# Altium schematic sheet MultiChannelLdc3.SchDoc
size A4
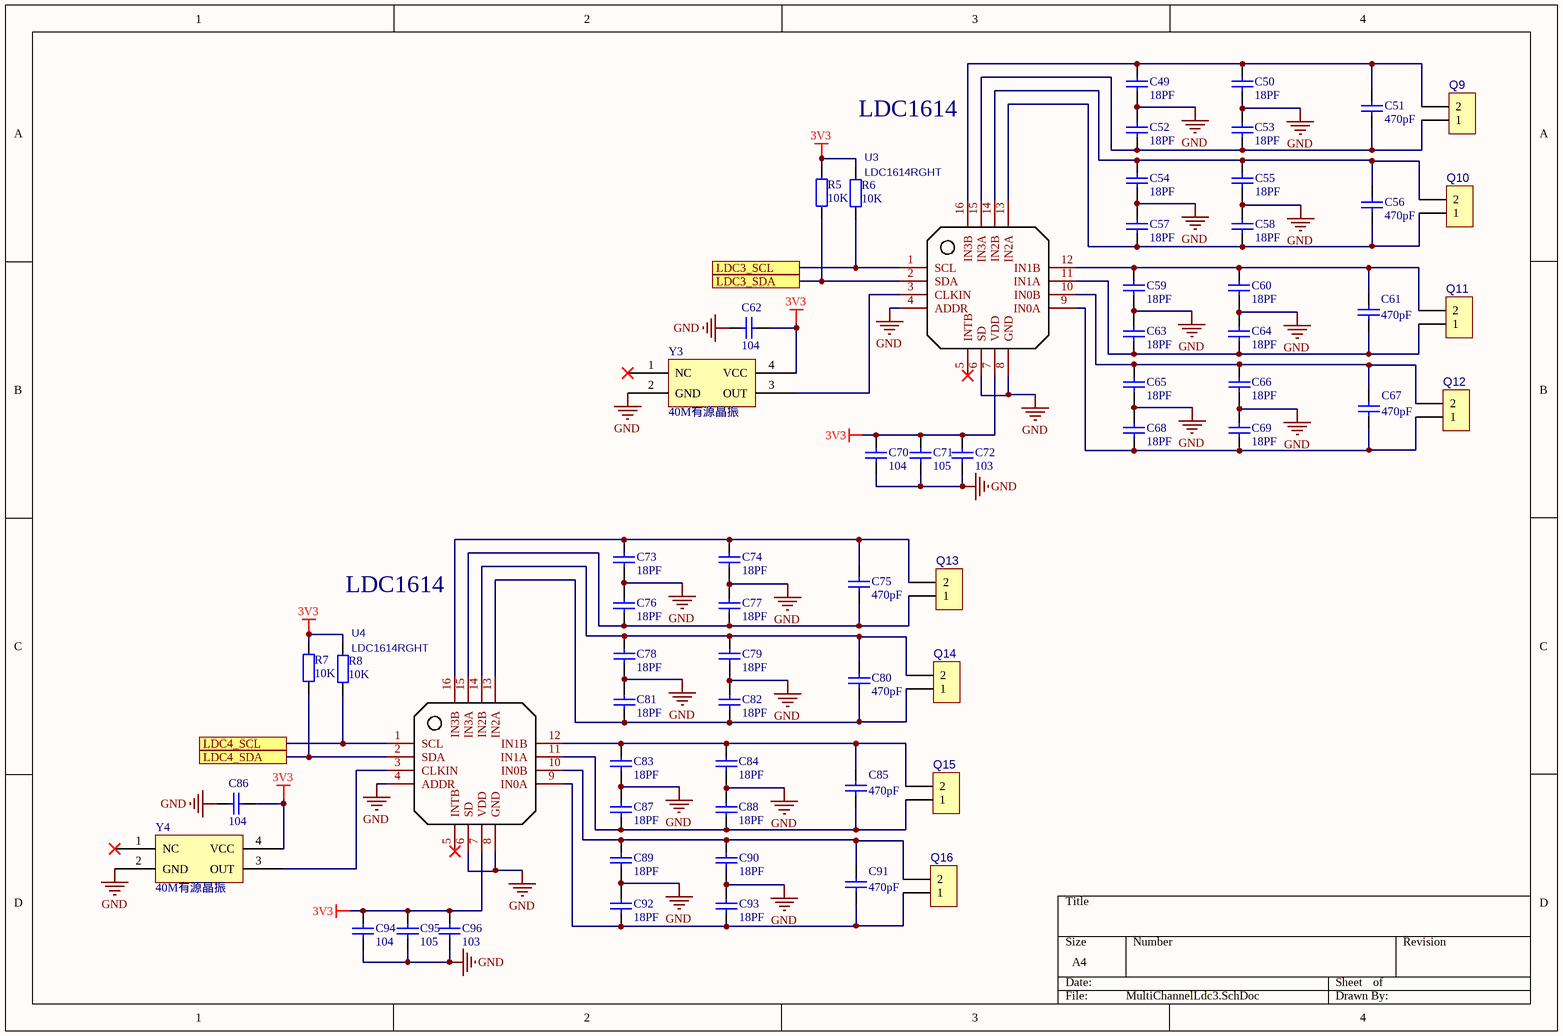
[diagram p0: MultiChannelLdc3.SchDoc]

## Parts
C49  18PF  [C0603_L]
C50  18PF  [C0603_L]
C51  470pF  [C0603_L]
C52  18PF  [C0603_L]
C53  18PF  [C0603_L]
C54  18PF  [C0603_L]
C55  18PF  [C0603_L]
C56  470pF  [C0603_L]
C57  18PF  [C0603_L]
C58  18PF  [C0603_L]
C59  18PF  [C0603_L]
C60  18PF  [C0603_L]
C61  470pF  [C0603_L]
C62  104  [C0603_L]
C63  18PF  [C0603_L]
C64  18PF  [C0603_L]
C65  18PF  [C0603_L]
C66  18PF  [C0603_L]
C67  470pF  [C0603_L]
C68  18PF  [C0603_L]
C69  18PF  [C0603_L]
C70  104  [C0603_L]
C71  105  [C0603_L]
C72  103  [C0603_L]
C73  18PF  [C0603_L]
C74  18PF  [C0603_L]
C75  470pF  [C0603_L]
C76  18PF  [C0603_L]
C77  18PF  [C0603_L]
C78  18PF  [C0603_L]
C79  18PF  [C0603_L]
C80  470pF  [C0603_L]
C81  18PF  [C0603_L]
C82  18PF  [C0603_L]
C83  18PF  [C0603_L]
C84  18PF  [C0603_L]
C85  470pF  [C0603_L]
C86  104  [C0603_L]
C87  18PF  [C0603_L]
C88  18PF  [C0603_L]
C89  18PF  [C0603_L]
C90  18PF  [C0603_L]
C91  470pF  [C0603_L]
C92  18PF  [C0603_L]
C93  18PF  [C0603_L]
C94  104  [C0603_L]
C95  105  [C0603_L]
C96  103  [C0603_L]
Q9  (no value)  [座子]
Q10  (no value)  [座子]
Q11  (no value)  [座子]
Q12  (no value)  [座子]
Q13  (no value)  [座子]
Q14  (no value)  [座子]
Q15  (no value)  [座子]
Q16  (no value)  [座子]
R5  value 10K  [R0603_L]  (hidden comment: Res2)
R6  value 10K  [R0603_L]  (hidden comment: Res2)
R7  value 10K  [R0603_L]  (hidden comment: Res2)
R8  value 10K  [R0603_L]  (hidden comment: Res2)
U3  LDC1614RGHT  [W-QFN-16]
U4  LDC1614RGHT  [W-QFN-16]
Y3  40M有源晶振  [SMD3225]
Y4  40M有源晶振  [SMD3225]

## Ports
LDC3_SCL, LDC3_SDA, LDC4_SCL, LDC4_SDA

## Nets
3V3: C62.1 C70.1 C71.1 C72.1 C86.1 C94.1 C95.1 C96.1 R5.2 R6.1 R7.2 R8.1 U3.7(VDD) U4.7(VDD) Y3.4(VCC) Y4.4(VCC)
GND: C49.2 C50.2 C52.1 C53.1 C54.2 C55.2 C57.1 C58.1 C59.2 C60.2 C62.2 C63.1 C64.1 C65.2 C66.2 C68.1 C69.1 C70.2 C71.2 C72.2 C73.2 C74.2 C76.1 C77.1 C78.2 C79.2 C81.1 C82.1 C83.2 C84.2 C86.2 C87.1 C88.1 C89.2 C90.2 C92.1 C93.1 C94.2 C95.2 C96.2 U3.4(ADDR) U3.6(SD) U3.8(GND) U4.4(ADDR) U4.6(SD) U4.8(GND) Y3.2(GND) Y4.2(GND)
LDC3_SCL: U3.1(SCL) ; port LDC3_SCL
LDC3_SDA: R5.1 U3.2(SDA) ; port LDC3_SDA
LDC4_SCL: U4.1(SCL) ; port LDC4_SCL
LDC4_SDA: R7.1 U4.2(SDA) ; port LDC4_SDA
NetC49_1: C49.1 C50.1 C51.2 Q9.2 U3.16(IN3B)
NetC51_1: C51.1 C52.2 C53.2 Q9.1 U3.15(IN3A)
NetC54_1: C54.1 C55.1 C56.2 Q10.2 U3.14(IN2B)
NetC56_1: C56.1 C57.2 C58.2 Q10.1 U3.13(IN2A)
NetC59_1: C59.1 C60.1 C61.2 Q11.2 U3.12(IN1B)
NetC61_1: C61.1 C63.2 C64.2 Q11.1 U3.11(IN1A)
NetC65_1: C65.1 C66.1 C67.2 Q12.2 U3.10(IN0B)
NetC67_1: C67.1 C68.2 C69.2 Q12.1 U3.9(IN0A)
NetC73_1: C73.1 C74.1 C75.2 Q13.2 U4.16(IN3B)
NetC75_1: C75.1 C76.2 C77.2 Q13.1 U4.15(IN3A)
NetC78_1: C78.1 C79.1 C80.2 Q14.2 U4.14(IN2B)
NetC80_1: C80.1 C81.2 C82.2 Q14.1 U4.13(IN2A)
NetC83_1: C83.1 C84.1 C85.2 Q15.2 U4.12(IN1B)
NetC85_1: C85.1 C87.2 C88.2 Q15.1 U4.11(IN1A)
NetC89_1: C89.1 C90.1 C91.2 Q16.2 U4.10(IN0B)
NetC91_1: C91.1 C92.2 C93.2 Q16.1 U4.9(IN0A)
NetU3_3: U3.3(CLKIN) Y3.3(OUT)
NetU4_3: U4.3(CLKIN) Y4.3(OUT)

Not connected (* = marked no-connect by the designer): R6 2; R8 2; U3 5(INTB)*; U4 5(INTB)*; Y3 1(NC)*; Y4 1(NC)*

## Notes on the sheet
- LDC1614

## Library data of the parts
C49-C61 C63-C69 C71-C85 C87-C93 C95 C96 = Cap: Capacitor; Value: 104; Published: 8-Jun-2000; LatestRevisionDate: 17-Jul-2002; LatestRevisionNote: Re-released for DXP Platform.; Publisher: Altium Limited
C62 C86 = C: 贴片电容/MLCC电容; BOM名称: 无极性贴片电容; 联系下单店铺卖家 免费帮你查找封装: 联系下单店铺卖家 免费技术支持
C70 C94 = Cap: Capacitor; Published: 8-Jun-2000; LatestRevisionDate: 17-Jul-2002; LatestRevisionNote: Re-released for DXP Platform.; Publisher: Altium Limited; Value: 104
Q9-Q16 = CON2: Connector
R5-R8 = Res2: Resistor; Published: 8-Jun-2000; LatestRevisionDate: 17-Jul-2002; LatestRevisionNote: Re-released for DXP Platform.; PackageReference: AXIAL-0.4; Publisher: Altium Limited; PackageDescription: Axial Device, Thru-Hole; 2 Leads; 0.4 in Pin Spacing
U3 U4 = LDC1614RGHT: BOM_Manufacturer: TI; BOM_Manufacturer Part: LDC1314RGHT; SMT Type: Extend; BOM_Supplier: LCSC; image: //image.lceda.cn/szlcsc/C80399.jpg; BOM_Supplier Part: C80399; BOM_LCSC Assembly: Yes; spicePre: U; spiceSymbolName: LDC1314RGHT
Y3 Y4 = 有源晶振